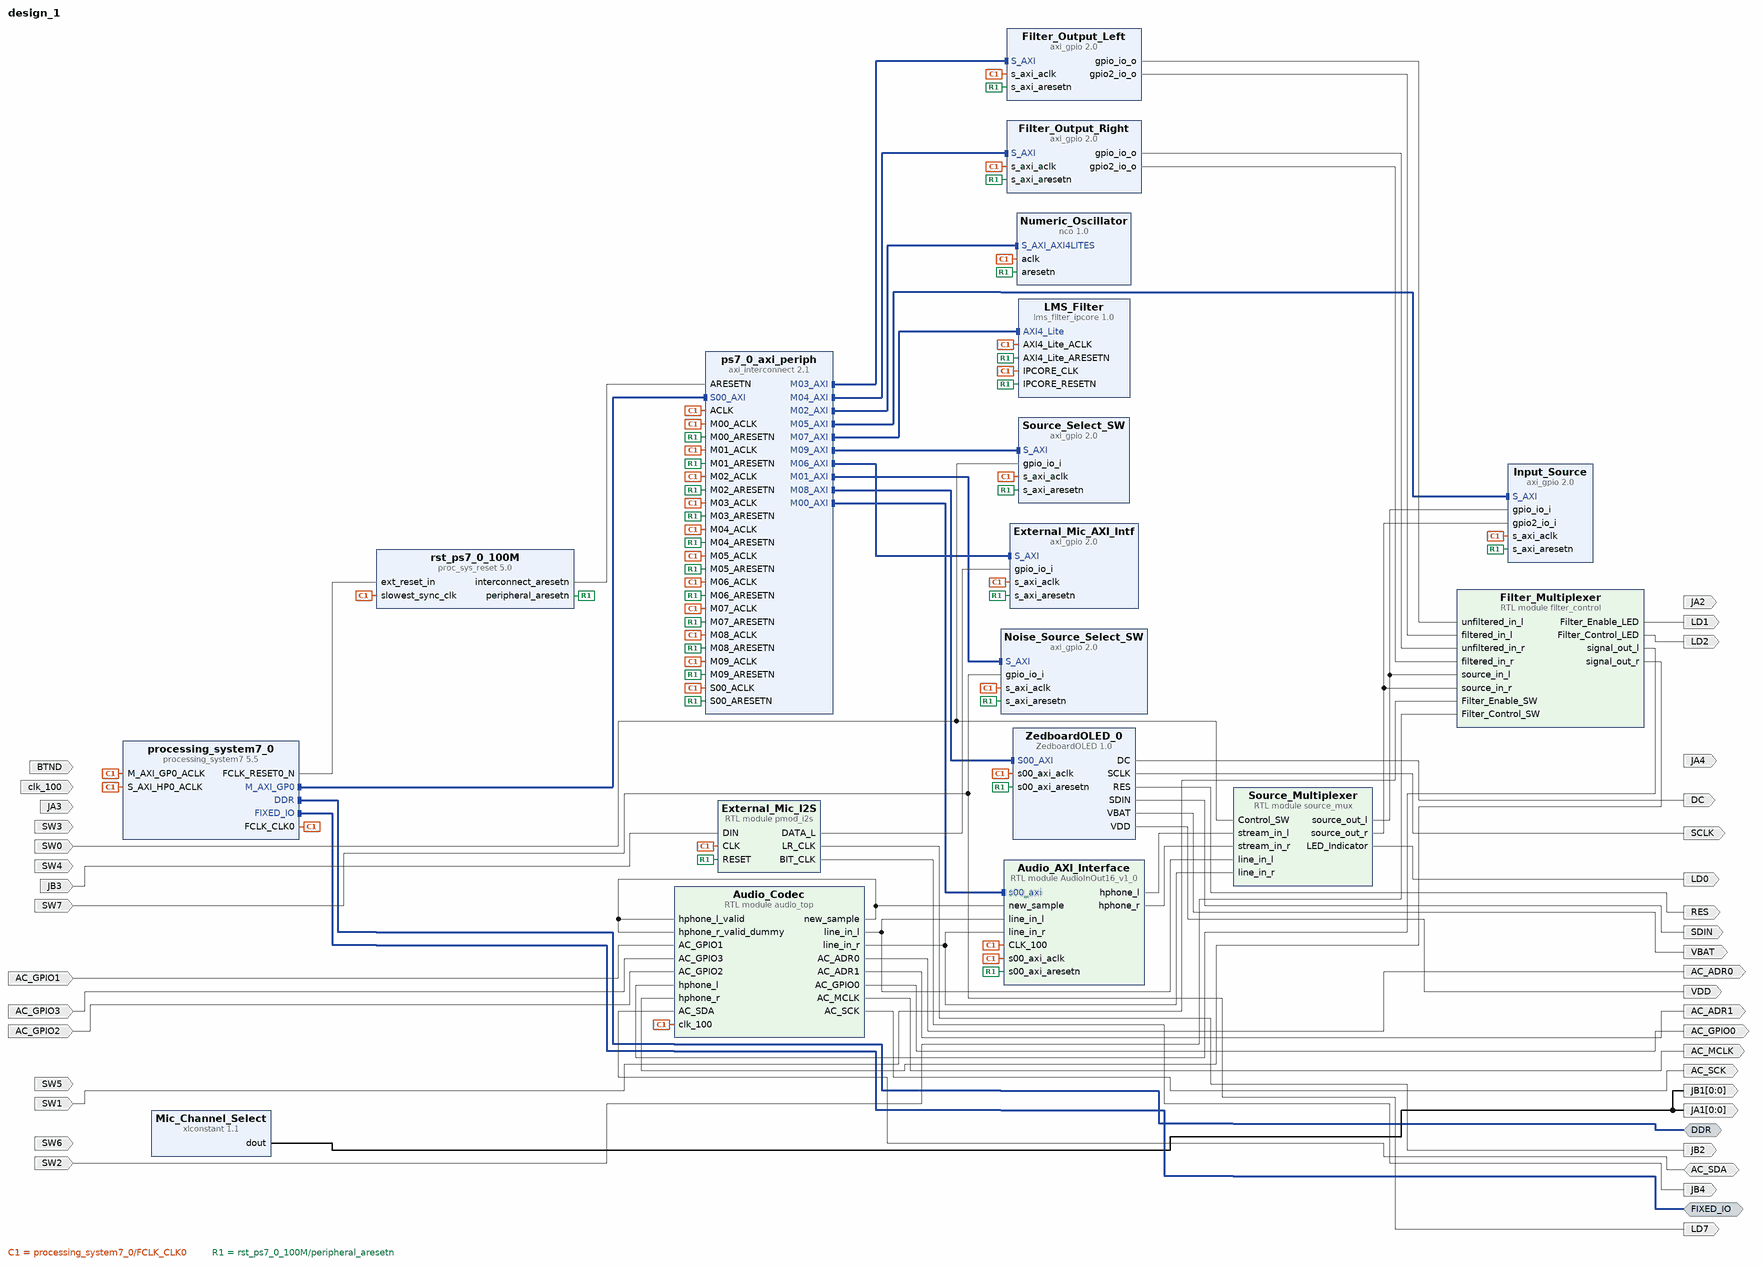
[diagram p0: block diagram of the top level]
# Vivado block design design_1, xc7z020clg484-1, Vivado 2017.3
create_bd_design design_1

create_bd_intf_port -mode Master -vlnv xilinx.com:interface:ddrx_rtl:1.0 DDR
create_bd_intf_port -mode Master -vlnv xilinx.com:display_processing_system7:fixedio_rtl:1.0 FIXED_IO
create_bd_port -dir I SW4
create_bd_port -dir I SW5
create_bd_port -dir I JA3
create_bd_port -dir O JA4
create_bd_port -dir O -type clk JA2
create_bd_port -dir I clk_100
create_bd_port -dir I SW6
create_bd_port -dir I -type rst BTND
set_property -dict {CONFIG.POLARITY ACTIVE_LOW} [get_bd_ports BTND]
create_bd_port -dir I SW3
create_bd_port -dir O SDIN
create_bd_port -dir O SCLK
create_bd_port -dir O DC
create_bd_port -dir O RES
create_bd_port -dir O VBAT
create_bd_port -dir O VDD
create_bd_port -dir I AC_GPIO1
create_bd_port -dir I AC_GPIO3
create_bd_port -dir I AC_GPIO2
create_bd_port -dir O AC_ADR0
create_bd_port -dir O AC_ADR1
create_bd_port -dir O AC_GPIO0
create_bd_port -dir O AC_MCLK
create_bd_port -dir O AC_SCK
create_bd_port -dir IO AC_SDA
create_bd_port -dir O -from 0 -to 0 JB1
create_bd_port -dir O -from 0 -to 0 JA1
create_bd_port -dir I SW0
create_bd_port -dir O -type clk JB2
create_bd_port -dir O -type clk JB4
create_bd_port -dir I JB3
create_bd_port -dir I SW1
create_bd_port -dir I SW2
create_bd_port -dir O LD0
create_bd_port -dir O LD1
create_bd_port -dir O LD2
create_bd_port -dir I SW7
create_bd_port -dir O LD7

create_bd_cell -type module -reference audio_top Audio_Codec
create_bd_cell -type ip -vlnv xilinx.com:ip:processing_system7:5.5 processing_system7_0
set_property -dict [list \
  CONFIG.PCW_UIPARAM_DDR_FREQ_MHZ 533.333313 \
  CONFIG.PCW_APU_PERIPHERAL_FREQMHZ 666.666667 \
  CONFIG.PCW_SDIO_PERIPHERAL_FREQMHZ 50 \
  CONFIG.PCW_UART_PERIPHERAL_FREQMHZ 50 \
  CONFIG.PCW_FPGA0_PERIPHERAL_FREQMHZ 100.000000 \
  CONFIG.PCW_FPGA1_PERIPHERAL_FREQMHZ 100 \
  CONFIG.PCW_FPGA2_PERIPHERAL_FREQMHZ 100 \
  CONFIG.PCW_USE_S_AXI_HP0 1 \
  CONFIG.PCW_S_AXI_HP0_DATA_WIDTH 32 \
  CONFIG.PCW_PERIPHERAL_BOARD_PRESET part0 \
  CONFIG.PCW_PRESET_BANK1_VOLTAGE {LVCMOS 1.8V} \
  CONFIG.PCW_UIPARAM_DDR_PARTNO {MT41J128M16 HA-15E} \
  CONFIG.PCW_QSPI_PERIPHERAL_ENABLE 1 \
  CONFIG.PCW_QSPI_QSPI_IO {MIO 1 .. 6} \
  CONFIG.PCW_QSPI_GRP_SINGLE_SS_ENABLE 1 \
  CONFIG.PCW_QSPI_GRP_SINGLE_SS_IO {MIO 1 .. 6} \
  CONFIG.PCW_SINGLE_QSPI_DATA_MODE x4 \
  CONFIG.PCW_ENET0_PERIPHERAL_ENABLE 1 \
  CONFIG.PCW_ENET0_ENET0_IO {MIO 16 .. 27} \
  CONFIG.PCW_ENET0_GRP_MDIO_ENABLE 1 \
  CONFIG.PCW_ENET0_GRP_MDIO_IO {MIO 52 .. 53} \
  CONFIG.PCW_ENET_RESET_ENABLE 1 \
  CONFIG.PCW_ENET_RESET_SELECT {Share reset pin} \
  CONFIG.PCW_ENET0_RESET_ENABLE 0 \
  CONFIG.PCW_SD0_PERIPHERAL_ENABLE 1 \
  CONFIG.PCW_SD0_SD0_IO {MIO 40 .. 45} \
  CONFIG.PCW_SD0_GRP_CD_ENABLE 1 \
  CONFIG.PCW_SD0_GRP_CD_IO {MIO 47} \
  CONFIG.PCW_SD0_GRP_WP_ENABLE 1 \
  CONFIG.PCW_SD0_GRP_WP_IO {MIO 46} \
  CONFIG.PCW_UART1_PERIPHERAL_ENABLE 1 \
  CONFIG.PCW_UART1_UART1_IO {MIO 48 .. 49} \
  CONFIG.PCW_TTC0_PERIPHERAL_ENABLE 1 \
  CONFIG.PCW_TTC0_TTC0_IO EMIO \
  CONFIG.PCW_USB0_PERIPHERAL_ENABLE 1 \
  CONFIG.PCW_USB0_USB0_IO {MIO 28 .. 39} \
  CONFIG.PCW_USB_RESET_ENABLE 1 \
  CONFIG.PCW_USB_RESET_SELECT {Share reset pin} \
  CONFIG.PCW_USB0_RESET_ENABLE 0 \
  CONFIG.PCW_I2C_RESET_ENABLE 1 \
  CONFIG.PCW_GPIO_MIO_GPIO_ENABLE 1 \
  CONFIG.PCW_GPIO_MIO_GPIO_IO MIO \
  CONFIG.preset ZedBoard \
] [get_bd_cells processing_system7_0]
# 505 more settings of processing_system7_0 are not shown: defaults, MIO pin electricals, DDR timing, and values the tool derives
create_bd_cell -type ip -vlnv xilinx.com:ip:proc_sys_reset:5.0 rst_ps7_0_100M
create_bd_cell -type ip -vlnv xilinx.com:ip:xlconstant:1.1 Mic_Channel_Select
set_property -dict {CONFIG.CONST_VAL 0} [get_bd_cells Mic_Channel_Select]
create_bd_cell -type module -reference AudioInOut16_v1_0 Audio_AXI_Interface
create_bd_cell -type ip -vlnv xilinx.com:hls:nco:1.0 Numeric_Oscillator
create_bd_cell -type module -reference source_mux Source_Multiplexer
create_bd_cell -type module -reference filter_control Filter_Multiplexer
create_bd_cell -type module -reference pmod_i2s External_Mic_I2S
create_bd_cell -type ip -vlnv xilinx.com:user:lms_filter_ipcore:1.0 LMS_Filter
create_bd_cell -type ip -vlnv xilinx.com:ip:axi_gpio:2.0 Filter_Output_Left
set_property -dict [list \
  CONFIG.C_GPIO_WIDTH 24 \
  CONFIG.C_GPIO2_WIDTH 24 \
  CONFIG.C_IS_DUAL 1 \
  CONFIG.C_ALL_OUTPUTS 1 \
  CONFIG.C_ALL_OUTPUTS_2 1 \
] [get_bd_cells Filter_Output_Left]
create_bd_cell -type ip -vlnv xilinx.com:ip:axi_gpio:2.0 Input_Source
set_property -dict [list \
  CONFIG.C_GPIO_WIDTH 24 \
  CONFIG.C_GPIO2_WIDTH 24 \
  CONFIG.C_IS_DUAL 1 \
  CONFIG.C_ALL_INPUTS 1 \
  CONFIG.C_ALL_INPUTS_2 1 \
] [get_bd_cells Input_Source]
create_bd_cell -type ip -vlnv xilinx.com:ip:axi_gpio:2.0 External_Mic_AXI_Intf
set_property -dict {CONFIG.C_GPIO_WIDTH 24 CONFIG.C_ALL_INPUTS 1} [get_bd_cells External_Mic_AXI_Intf]
create_bd_cell -type ip -vlnv xilinx.com:ip:axi_gpio:2.0 Noise_Source_Select_SW
set_property -dict {CONFIG.C_GPIO_WIDTH 1 CONFIG.C_ALL_INPUTS 1} [get_bd_cells Noise_Source_Select_SW]
create_bd_cell -type ip -vlnv xilinx.com:ip:axi_gpio:2.0 Filter_Output_Right
set_property -dict [list \
  CONFIG.C_GPIO_WIDTH 24 \
  CONFIG.C_GPIO2_WIDTH 24 \
  CONFIG.C_IS_DUAL 1 \
  CONFIG.C_ALL_OUTPUTS 1 \
  CONFIG.C_ALL_OUTPUTS_2 1 \
] [get_bd_cells Filter_Output_Right]
create_bd_cell -type ip -vlnv xilinx.com:ip:axi_interconnect:2.1 ps7_0_axi_periph
set_property -dict {CONFIG.NUM_MI 10} [get_bd_cells ps7_0_axi_periph]
create_bd_cell -type ip -vlnv tamu.edu:user:ZedboardOLED:1.0 ZedboardOLED_0
create_bd_cell -type ip -vlnv xilinx.com:ip:axi_gpio:2.0 Source_Select_SW
set_property -dict {CONFIG.C_GPIO_WIDTH 1 CONFIG.C_ALL_INPUTS 1} [get_bd_cells Source_Select_SW]

# ---- connections ----

connect_bd_intf_net [get_bd_intf_pins processing_system7_0/M_AXI_GP0] [get_bd_intf_pins ps7_0_axi_periph/S00_AXI]
connect_bd_intf_net [get_bd_intf_pins ps7_0_axi_periph/M00_AXI] [get_bd_intf_pins Audio_AXI_Interface/s00_axi]
connect_bd_intf_net [get_bd_intf_pins ps7_0_axi_periph/M02_AXI] [get_bd_intf_pins Numeric_Oscillator/S_AXI_AXI4LITES]
connect_bd_intf_net [get_bd_intf_pins ps7_0_axi_periph/M03_AXI] [get_bd_intf_pins Filter_Output_Left/S_AXI]
connect_bd_intf_net [get_bd_intf_pins ps7_0_axi_periph/M04_AXI] [get_bd_intf_pins Filter_Output_Right/S_AXI]
connect_bd_intf_net [get_bd_intf_pins ps7_0_axi_periph/M05_AXI] [get_bd_intf_pins Input_Source/S_AXI]
connect_bd_intf_net [get_bd_intf_pins ps7_0_axi_periph/M06_AXI] [get_bd_intf_pins External_Mic_AXI_Intf/S_AXI]
connect_bd_intf_net [get_bd_intf_pins ps7_0_axi_periph/M07_AXI] [get_bd_intf_pins LMS_Filter/AXI4_Lite]
connect_bd_intf_net [get_bd_intf_pins ps7_0_axi_periph/M01_AXI] [get_bd_intf_pins Noise_Source_Select_SW/S_AXI]
connect_bd_intf_net [get_bd_intf_pins ps7_0_axi_periph/M08_AXI] [get_bd_intf_pins ZedboardOLED_0/S00_AXI]
connect_bd_intf_net [get_bd_intf_pins ps7_0_axi_periph/M09_AXI] [get_bd_intf_pins Source_Select_SW/S_AXI]
connect_bd_intf_net [get_bd_intf_ports DDR] [get_bd_intf_pins processing_system7_0/DDR]
connect_bd_intf_net [get_bd_intf_ports FIXED_IO] [get_bd_intf_pins processing_system7_0/FIXED_IO]
connect_bd_net -net AC_GPIO1_0_2 [get_bd_ports AC_GPIO1] [get_bd_pins Audio_Codec/AC_GPIO1]
connect_bd_net -net AC_GPIO3_0_2 [get_bd_ports AC_GPIO3] [get_bd_pins Audio_Codec/AC_GPIO3]
connect_bd_net -net AC_GPIO2_0_2 [get_bd_ports AC_GPIO2] [get_bd_pins Audio_Codec/AC_GPIO2]
connect_bd_net [get_bd_pins processing_system7_0/FCLK_CLK0] \
  [get_bd_pins processing_system7_0/M_AXI_GP0_ACLK] [get_bd_pins processing_system7_0/S_AXI_HP0_ACLK] \
  [get_bd_pins rst_ps7_0_100M/slowest_sync_clk] [get_bd_pins Audio_Codec/clk_100] [get_bd_pins Audio_AXI_Interface/CLK_100] \
  [get_bd_pins Audio_AXI_Interface/s00_axi_aclk] [get_bd_pins Numeric_Oscillator/aclk] [get_bd_pins External_Mic_I2S/CLK] \
  [get_bd_pins LMS_Filter/IPCORE_CLK] [get_bd_pins LMS_Filter/AXI4_Lite_ACLK] [get_bd_pins Filter_Output_Left/s_axi_aclk] \
  [get_bd_pins Input_Source/s_axi_aclk] [get_bd_pins External_Mic_AXI_Intf/s_axi_aclk] \
  [get_bd_pins Noise_Source_Select_SW/s_axi_aclk] [get_bd_pins Filter_Output_Right/s_axi_aclk] \
  [get_bd_pins ps7_0_axi_periph/ACLK] [get_bd_pins ps7_0_axi_periph/S00_ACLK] [get_bd_pins ps7_0_axi_periph/M00_ACLK] \
  [get_bd_pins ps7_0_axi_periph/M01_ACLK] [get_bd_pins ps7_0_axi_periph/M02_ACLK] [get_bd_pins ps7_0_axi_periph/M03_ACLK] \
  [get_bd_pins ps7_0_axi_periph/M04_ACLK] [get_bd_pins ps7_0_axi_periph/M05_ACLK] [get_bd_pins ps7_0_axi_periph/M06_ACLK] \
  [get_bd_pins ps7_0_axi_periph/M07_ACLK] [get_bd_pins ps7_0_axi_periph/M08_ACLK] [get_bd_pins ZedboardOLED_0/s00_axi_aclk] \
  [get_bd_pins Source_Select_SW/s_axi_aclk] [get_bd_pins ps7_0_axi_periph/M09_ACLK]
connect_bd_net [get_bd_pins processing_system7_0/FCLK_RESET0_N] [get_bd_pins rst_ps7_0_100M/ext_reset_in]
connect_bd_net [get_bd_pins rst_ps7_0_100M/interconnect_aresetn] [get_bd_pins ps7_0_axi_periph/ARESETN]
connect_bd_net -net AudioInOut16_v1_0_0_AC_ADR0 [get_bd_pins Audio_Codec/AC_ADR0] [get_bd_ports AC_ADR0]
connect_bd_net -net AudioInOut16_v1_0_0_AC_ADR1 [get_bd_pins Audio_Codec/AC_ADR1] [get_bd_ports AC_ADR1]
connect_bd_net -net AudioInOut16_v1_0_0_AC_GPIO0 [get_bd_pins Audio_Codec/AC_GPIO0] [get_bd_ports AC_GPIO0]
connect_bd_net -net AudioInOut16_v1_0_0_AC_MCLK [get_bd_pins Audio_Codec/AC_MCLK] [get_bd_ports AC_MCLK]
connect_bd_net -net AudioInOut16_v1_0_0_AC_SCK [get_bd_pins Audio_Codec/AC_SCK] [get_bd_ports AC_SCK]
connect_bd_net [get_bd_ports AC_SDA] [get_bd_pins Audio_Codec/AC_SDA]
connect_bd_net -net audio_top_0_new_sample [get_bd_pins Audio_Codec/new_sample] \
  [get_bd_pins Audio_AXI_Interface/new_sample] [get_bd_pins Audio_Codec/hphone_l_valid] \
  [get_bd_pins Audio_Codec/hphone_r_valid_dummy]
connect_bd_net -net xlconstant_1_dout [get_bd_pins Mic_Channel_Select/dout] [get_bd_ports JA1] [get_bd_ports JB1]
connect_bd_net -net audio_top_0_line_in_l [get_bd_pins Audio_Codec/line_in_l] \
  [get_bd_pins Audio_AXI_Interface/line_in_l] [get_bd_pins Source_Multiplexer/line_in_l]
connect_bd_net -net audio_top_0_line_in_r [get_bd_pins Audio_Codec/line_in_r] \
  [get_bd_pins Audio_AXI_Interface/line_in_r] [get_bd_pins Source_Multiplexer/line_in_r]
connect_bd_net [get_bd_pins rst_ps7_0_100M/peripheral_aresetn] \
  [get_bd_pins Audio_AXI_Interface/s00_axi_aresetn] [get_bd_pins Numeric_Oscillator/aresetn] \
  [get_bd_pins External_Mic_I2S/RESET] [get_bd_pins LMS_Filter/IPCORE_RESETN] [get_bd_pins LMS_Filter/AXI4_Lite_ARESETN] \
  [get_bd_pins Filter_Output_Left/s_axi_aresetn] [get_bd_pins Input_Source/s_axi_aresetn] \
  [get_bd_pins External_Mic_AXI_Intf/s_axi_aresetn] [get_bd_pins Noise_Source_Select_SW/s_axi_aresetn] \
  [get_bd_pins Filter_Output_Right/s_axi_aresetn] [get_bd_pins ps7_0_axi_periph/S00_ARESETN] \
  [get_bd_pins ps7_0_axi_periph/M00_ARESETN] [get_bd_pins ps7_0_axi_periph/M01_ARESETN] \
  [get_bd_pins ps7_0_axi_periph/M02_ARESETN] [get_bd_pins ps7_0_axi_periph/M03_ARESETN] \
  [get_bd_pins ps7_0_axi_periph/M04_ARESETN] [get_bd_pins ps7_0_axi_periph/M05_ARESETN] \
  [get_bd_pins ps7_0_axi_periph/M06_ARESETN] [get_bd_pins ps7_0_axi_periph/M07_ARESETN] \
  [get_bd_pins ps7_0_axi_periph/M08_ARESETN] [get_bd_pins ZedboardOLED_0/s00_axi_aresetn] \
  [get_bd_pins Source_Select_SW/s_axi_aresetn] [get_bd_pins ps7_0_axi_periph/M09_ARESETN]
connect_bd_net -net SW0_1 [get_bd_ports SW0] [get_bd_pins Source_Multiplexer/Control_SW] [get_bd_pins Source_Select_SW/gpio_io_i]
connect_bd_net -net AudioInOut16_v1_0_0_hphone_l [get_bd_pins Audio_AXI_Interface/hphone_l] [get_bd_pins Source_Multiplexer/stream_in_l]
connect_bd_net -net AudioInOut16_v1_0_0_hphone_r [get_bd_pins Audio_AXI_Interface/hphone_r] [get_bd_pins Source_Multiplexer/stream_in_r]
connect_bd_net -net pmod_i2s_1_LR_CLK [get_bd_pins External_Mic_I2S/LR_CLK] [get_bd_ports JB2]
connect_bd_net -net pmod_i2s_1_BIT_CLK [get_bd_pins External_Mic_I2S/BIT_CLK] [get_bd_ports JB4]
connect_bd_net -net DIN_0_1 [get_bd_ports JB3] [get_bd_pins External_Mic_I2S/DIN]
connect_bd_net -net SW1_1 [get_bd_ports SW1] [get_bd_pins Filter_Multiplexer/Filter_Enable_SW]
connect_bd_net -net SW2_1 [get_bd_ports SW2] [get_bd_pins Filter_Multiplexer/Filter_Control_SW]
connect_bd_net -net source_mux_0_source_out_l [get_bd_pins Source_Multiplexer/source_out_l] \
  [get_bd_pins Filter_Multiplexer/source_in_l] [get_bd_pins Input_Source/gpio_io_i]
connect_bd_net -net source_mux_0_source_out_r [get_bd_pins Source_Multiplexer/source_out_r] \
  [get_bd_pins Filter_Multiplexer/source_in_r] [get_bd_pins Input_Source/gpio2_io_i]
connect_bd_net -net source_mux_0_LED_Indicator [get_bd_pins Source_Multiplexer/LED_Indicator] [get_bd_ports LD0]
connect_bd_net -net filter_control_0_Filter_Enable_LED [get_bd_pins Filter_Multiplexer/Filter_Enable_LED] [get_bd_ports LD1]
connect_bd_net -net filter_control_0_Filter_Control_LED [get_bd_pins Filter_Multiplexer/Filter_Control_LED] [get_bd_ports LD2]
connect_bd_net -net filter_control_0_signal_out_l [get_bd_pins Filter_Multiplexer/signal_out_l] [get_bd_pins Audio_Codec/hphone_l]
connect_bd_net -net filter_control_0_signal_out_r [get_bd_pins Filter_Multiplexer/signal_out_r] [get_bd_pins Audio_Codec/hphone_r]
connect_bd_net [get_bd_pins Filter_Output_Left/gpio_io_o] [get_bd_pins Filter_Multiplexer/unfiltered_in_l]
connect_bd_net [get_bd_pins Filter_Output_Left/gpio2_io_o] [get_bd_pins Filter_Multiplexer/filtered_in_l]
connect_bd_net [get_bd_pins Filter_Output_Right/gpio_io_o] [get_bd_pins Filter_Multiplexer/unfiltered_in_r]
connect_bd_net [get_bd_pins Filter_Output_Right/gpio2_io_o] [get_bd_pins Filter_Multiplexer/filtered_in_r]
connect_bd_net -net mic_external_DATA_L [get_bd_pins External_Mic_I2S/DATA_L] [get_bd_pins External_Mic_AXI_Intf/gpio_io_i]
connect_bd_net -net SW7_1 [get_bd_ports SW7] [get_bd_ports LD7] [get_bd_pins Noise_Source_Select_SW/gpio_io_i]
connect_bd_net [get_bd_pins ZedboardOLED_0/SDIN] [get_bd_ports SDIN]
connect_bd_net [get_bd_pins ZedboardOLED_0/SCLK] [get_bd_ports SCLK]
connect_bd_net [get_bd_pins ZedboardOLED_0/DC] [get_bd_ports DC]
connect_bd_net [get_bd_pins ZedboardOLED_0/RES] [get_bd_ports RES]
connect_bd_net [get_bd_pins ZedboardOLED_0/VBAT] [get_bd_ports VBAT]
connect_bd_net [get_bd_pins ZedboardOLED_0/VDD] [get_bd_ports VDD]

# ---- address map ----
assign_bd_address -offset 0x41200000 -range 64K -target_address_space [get_bd_addr_spaces processing_system7_0/Data] [get_bd_addr_segs Filter_Output_Left/S_AXI/Reg]
assign_bd_address -offset 0x41210000 -range 64K -target_address_space [get_bd_addr_spaces processing_system7_0/Data] [get_bd_addr_segs Filter_Output_Right/S_AXI/Reg]
assign_bd_address -offset 0x41220000 -range 64K -target_address_space [get_bd_addr_spaces processing_system7_0/Data] [get_bd_addr_segs Input_Source/S_AXI/Reg]
assign_bd_address -offset 0x41230000 -range 32K -target_address_space [get_bd_addr_spaces processing_system7_0/Data] [get_bd_addr_segs External_Mic_AXI_Intf/S_AXI/Reg]
assign_bd_address -offset 0x41238000 -range 4K -target_address_space [get_bd_addr_spaces processing_system7_0/Data] [get_bd_addr_segs Noise_Source_Select_SW/S_AXI/Reg]
assign_bd_address -offset 0x41240000 -range 64K -target_address_space [get_bd_addr_spaces processing_system7_0/Data] [get_bd_addr_segs Source_Select_SW/S_AXI/Reg]
assign_bd_address -offset 0x43C00000 -range 64K -target_address_space [get_bd_addr_spaces processing_system7_0/Data] [get_bd_addr_segs Audio_AXI_Interface/s00_axi/reg0]
assign_bd_address -offset 0x43C10000 -range 64K -target_address_space [get_bd_addr_spaces processing_system7_0/Data] [get_bd_addr_segs LMS_Filter/AXI4_Lite/reg0]
assign_bd_address -offset 0x43C20000 -range 32K -target_address_space [get_bd_addr_spaces processing_system7_0/Data] [get_bd_addr_segs Numeric_Oscillator/S_AXI_AXI4LITES/Reg]
assign_bd_address -offset 0x43C30000 -range 64K -target_address_space [get_bd_addr_spaces processing_system7_0/Data] [get_bd_addr_segs ZedboardOLED_0/S00_AXI/S00_AXI_reg]

validate_bd_design
save_bd_design
